# EAGLE design rectificador (EAGLE 9.6.2)
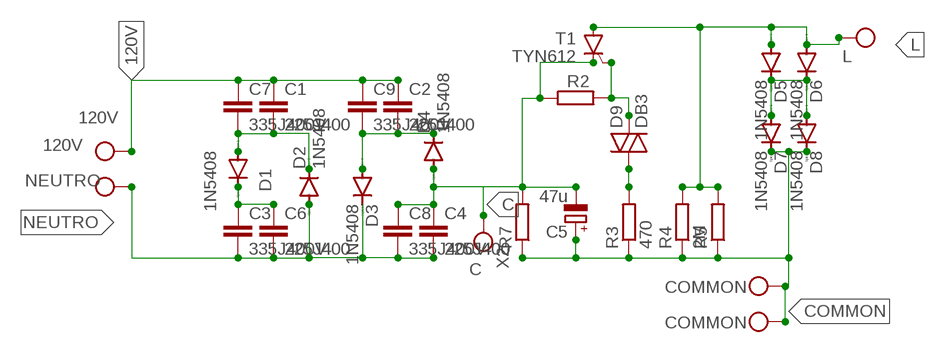
[diagram p0: schematic, sheet 1]

## Parts
C1  225J400  C15/9  [C15B9]
C2  225J400  C15/9  [C15B9]
C3  335J400V  C15/9  [C15B9]
C4  225J400  C15/9  [C15B9]
C5  47u  CPOL-EUE2-5  [E2-5]
C6  225J400  C15/9  [C15B9]
C7  335J400V  C15/9  [C15B9]
C8  335J400V  C15/9  [C15B9]
C9  335J400V  C15/9  [C15B9]
D1  1N5408  1N5400  [DO201-15]
D2  1N5408  1N5400  [DO201-15]
D3  1N5408  1N5400  [DO201-15]
D4  1N5408  1N5400  [DO201-15]
D5  1N5408  1N5400  [DO201-15]
D6  1N5408  1N5400  [DO201-15]
D7  1N5408  1N5400  [DO201-15]
D8  1N5408  1N5400  [DO201-15]
D9  DB3  DIAC-DO35-10  [DO35-10]
R2  R-EU_0207/10  [0207/10]
R3  470  R-EU_0207/10  [0207/10]
R4  2M  R-EU_0207/10  [0207/10]
R5  R-EU_0207/10  [0207/10]
R7  R-EU_0207/10  [0207/10]
T1  TYN612  TIC126  [TO220CS]
VIN  120V  W237-102  [W237-102]
X2  X2  W237-4  [W237-4]

## Nets
120V: C1.1 C2.1 C7.1 C9.1 VIN.2
C: C4.1 C5.- C8.1 D4.A R2.1 R7.2 T1.C X2.4
COMMON: C5.+ D7.C D8.C R3.1 R4.1 R5.1 R7.1 X2.2 X2.3
L: D5.A D6.A R4.2 R5.2 T1.A X2.1
N$1: D9.A R3.2
N$3: C3.1 C6.1 D1.C
N$6: C2.2 C9.2 D3.A D4.C
N$17: C1.2 C7.2 D1.A D2.C
N$21: D5.C D6.C D7.A D8.A
N$49: D9.C R2.2 T1.G
NEUTRO: C3.2 C4.2 C6.2 C8.2 D2.A D3.C VIN.1

## Library data of the parts
C1-C4 C7-C9 = capacitor-wima:C: CAPACITOR naming: grid - package width; OC_NEWARK: unknown
C5 = rcl:CPOL-EU: POLARIZED CAPACITOR, European symbol; MF: PEPPERL+FUCHS; MPN: V3-WM-E2-5M-PUR; OC_NEWARK: 29M6143; SPICEPREFIX: C
C6 = capacitor-wima:C: CAPACITOR naming: grid - package width; OC_NEWARK: unknown; SPICEPREFIX: C
D1-D8 = diode:1N5400: DIODE standard rectifier, 3 A, 50 V (Motorola); OC_NEWARK: unknown
D9 = diode:DIAC-: DIAC; OC_NEWARK: unknown
R2-R5 R7 = rcl:R-EU_: RESISTOR, European symbol; OC_NEWARK: unknown; SPICEPREFIX: R
T1 = triac:TIC126: THYRISTOR; OC_NEWARK: unknown
VIN = con-wago-500:W237-102: WAGO SCREW CLAMP; MF: WAGO; MPN: 237-102; OC_FARNELL: unknown; OC_NEWARK: 70K9898
X2 = con-wago-500:W237-4: WAGO SCREW CLAMP; OC_FARNELL: unknown; OC_NEWARK: unknown

## Board
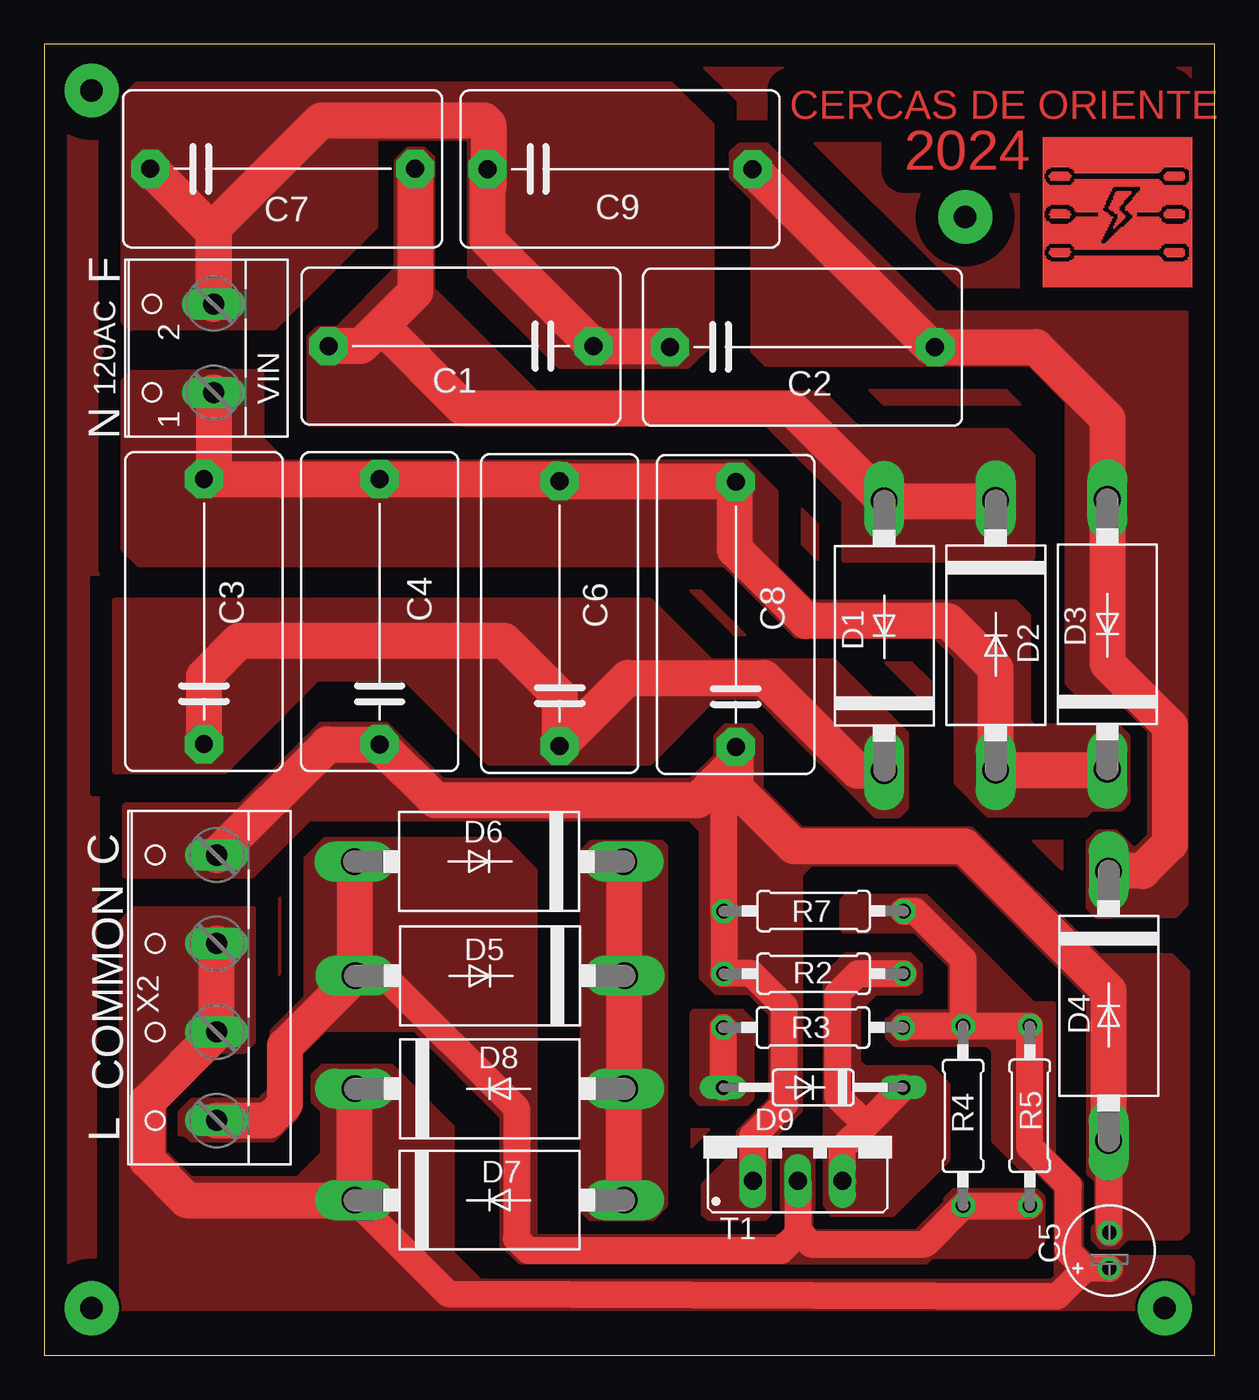
[diagram p1: board, top side]
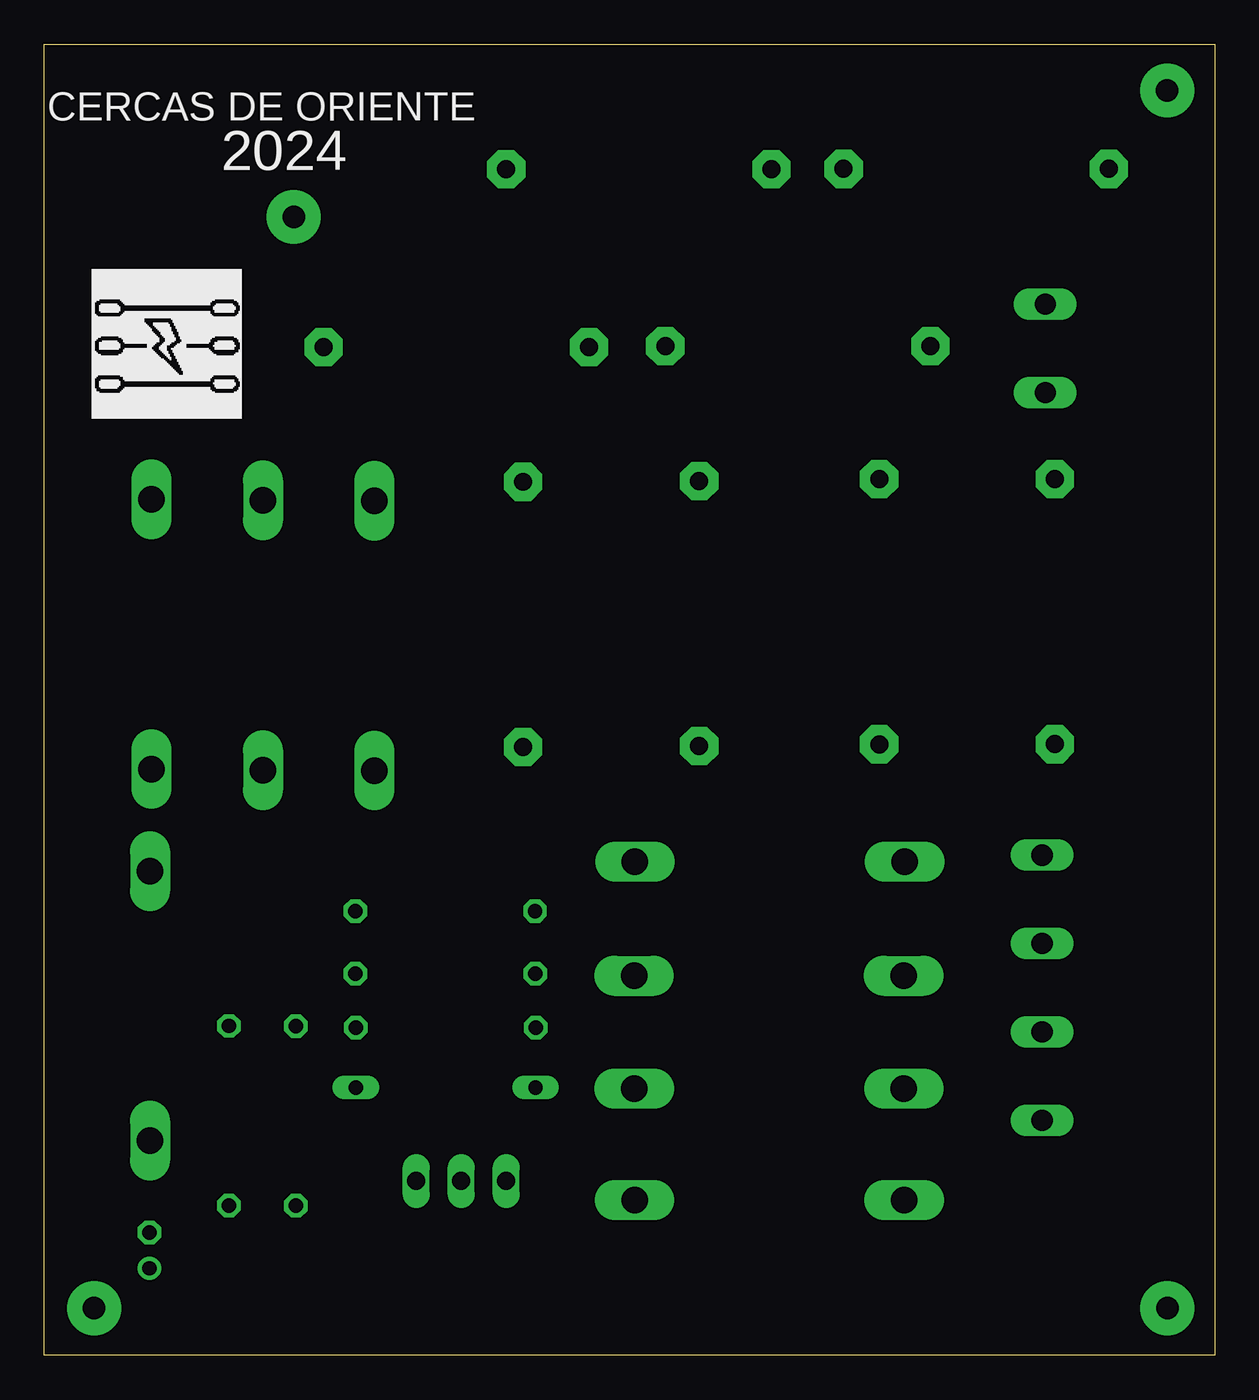
[diagram p2: board, bottom side, seen from below]

Size 66.16 x 74.1 mm. Coordinates in mm from the lower left corner, seen from the top.
Outline: 0,0 66.16,0 66.16,74.1 0,74.1 0,0
Copper layers (1*16): Top 0.035mm / dielectric 1.5mm / Bottom 0.035mm
Design rules "default *": minimum track width 6mil, minimum drill 0.35mm, track to track 6mil, track to pad 6mil, pad to pad 6mil, via to via 6mil, smd to smd 6mil, copper to edge 40mil, drill to drill 6mil, minimum pad ring 10mil, minimum via ring 8mil, stop-mask expansion 4mil, vias tented up to drill 0mil, thermal gap 10mil

### Footprints (pad centres in the part's own frame; a part is rotated, then mirrored left to right if it is on the bottom)
C15B9 = drill 1.016 pad 2.159 octagon: 1 -7.493,0; 2 7.493,0
E2-5 = drill 0.813 pad 1.27: + -1.016,0 | drill 0.813 pad 1.27 octagon: - 1.016,0
DO201-15 = drill 1.499 long: A 7.62,0; C -7.62,0
DO35-10 = drill 0.813 long: A 5.08,0; C -5.08,0
0207/10 = drill 0.813 octagon: 1 -5.08,0; 2 5.08,0
TO220CS = drill 1.016 long: A 0,-2.54; C -2.54,-2.54; G 2.54,-2.54
W237-102 = drill 1.194 long: 1 -2.5,-1.27; 2 2.5,-1.27
W237-4 = drill 1.194 long: 1 -7.5,-1.27; 2 -2.5,-1.27; 3 2.5,-1.27; 4 7.5,-1.27

### Placement (x,y rotation side)
C1  23.56,57.04 180 top
C2  42.86,56.98 0 top
C3  9.03,42.03 90 top
C4  18.96,42.03 90 top
C5  60.21,5.93 90 top
C6  29.13,41.93 90 top
C7  13.47,67.06 0 top
C8  39.09,41.88 90 top
C9  32.55,67.05 0 top
D1  47.48,40.67 90 top
D2  53.79,40.7 270 top
D3  60.09,40.75 90 top
D4  60.17,19.75 270 top
D5  25.19,21.45 180 top
D6  25.15,27.91 180 top
D7  25.17,8.77 0 top
D8  25.18,15.06 0 top
D9  43.46,15.13 180 top
R2  43.48,21.57 0 top
R3  43.46,18.53 180 top
R4  51.93,13.53 270 top
R5  55.71,13.54 270 top
R7  43.49,25.11 180 top
T1  42.59,12.4 0 top
VIN  8.3,56.92 90 top
X2  8.48,20.77 90 top

### Tracks (layer width: path | path; a pad name or v marks a point on that pad's centre or on a via)
120V
  Top 2.032: C7.1 9.57,63.47 VIN.2 9.57,63.73 15.65,69.8 24.87,69.8 25.11,69.56 25.11,65.98 25.06,65.93 | 25.06,65.93 25.06,63.04 C1.1 35.31,57.04 C2.1 | 25.06,65.93 C9.1
  pour Top (no thermals): 4.54,58.39 4.88,58.05 13.02,58.05 18.77,63.8 18.77,68.74 18.8,68.77 24.02,68.77 24.02,60.97 29.12,55.87 36.39,55.87 37.76,57.24 37.76,69.55 35.43,71.88 5.22,71.88 4.44,71.1 4.44,58.42 4.88,57.98
C
  Top 1.524: R2.1 R7.2 38.41,32.85 39.09,33.53 | R2.1 | T1.C 40.05,12.4 41.85,14.2 41.85,19.72 39.99,21.57 R2.1 | C5.- 60.21,12.09 D4.A
  Top 2.032: X2.4 16.02,34.54 C4.1 22.11,31.38 36.94,31.38 39.09,33.53 | 39.09,33.53 C8.1 | D4.A 60.17,20.6 52,28.76 42.38,28.76 39.09,32.05 39.09,33.53
  pour Top (no thermals): 4.7,27.07 11.76,27.07 15,30.3 36.48,30.3 36.94,29.85 37.13,29.66 37.13,21.32 37.97,20.48 39.85,20.48 41.04,19.29 41.04,14.46 39.2,12.63 39.2,11.61 37.24,9.65 37.24,8.01 37.54,7.71 40.74,7.71 41.02,7.99 41.02,12.11 42.77,13.86 42.77,14.22 42.77,27.17 43.33,27.73 51.58,27.73 59.02,20.29 59.02,10.3 59.46,9.86 59.46,7.4 59.26,7.21 59.28,7.19 59.28,6.56 59.67,6.17 59.67,6.13 59.69,6.11 60.56,6.11 60.69,6.11 61.18,6.6 64.23,6.6 64.64,7.01 64.64,21.69 63.73,22.6 59.6,22.6 52.42,29.78 42.79,29.78 42.59,29.98 40.54,32.03 40.54,34.99 39.94,35.59 38.51,35.59 37.93,35.01 37.93,33.86 36.57,32.5 22.51,32.5 19.34,35.68 15.63,35.68 11.09,31.14 4.59,31.14 4.51,31.06 4.51,27.09 4.59,27.09
COMMON
  Top 1.524: R3.1 48.62,18.61 R4.1 | R4.1 R5.1 55.71,11.78 57.89,9.6 57.89,5.84 58.82,4.91 | R7.1 49.22,25.11 51.94,22.4 R4.1 | C5.+ 58.82,4.91 | D7.C 22.83,3.48 57.26,3.34 58.82,4.9 58.82,4.91
  Top 2.032: X2.3 X2.2 5.81,14.33 5.81,11.01 8.05,8.77 D7.C 17.55,15.05 D8.C
  pour Top (no thermals): 11.59,17.47 11.83,17.7 11.83,25.25 5.08,25.25 4.83,25.01 4.35,24.52 4.35,2.63 64.19,2.63 64.93,3.37 64.93,5.29 64.68,5.54 59.21,5.54 58.65,6.1 58.65,9.78 58.12,10.31 57.06,11.37 57.06,19.88 55.9,19.88 49.83,25.95 45.31,25.95 45.06,25.71 45.06,24.12 45.21,23.97 49.25,23.97 51.2,22.01 51.2,19.47 51.18,19.45 48.21,19.45 48.16,19.4 47.75,18.99 47.64,18.99 47.64,18 48.09,17.56 53.32,17.56 53.64,17.24 53.64,12.11 55.31,10.44 55.96,10.44 56.01,10.4 56.1,10.4 57.17,9.33 57.17,4.43 56.94,4.2 24.64,4.2 23.08,5.76 23.08,12.92 19.63,16.37 15.72,16.37 15.17,15.81 15.17,14.36 15.7,13.83 15.7,11.38 14.32,10.01 8.31,10.01 6.8,11.51 6.8,14.04 6.96,14.2 9.92,17.16 10.15,17.16 11.29,17.16 11.34,17.21 11.62,17.49 11.62,17.49
L
  Top 1.524: R5.2 R4.2 49.77,6.29 43.36,6.29 42.59,7.05 T1.A 42.59,6.85 41.67,5.93 27.36,5.93 26.69,6.59 26.69,13.97 19.21,21.45 D5.A
  Top 2.032: D6.A 17.57,27.87 D5.A 13.62,17.49 13.62,14.19 12.69,13.27 X2.1
  pour Top (no thermals): 50.14,5.57 55.57,5.57 56.47,6.47 56.47,8.94 56.08,9.33 51.46,9.33 51.44,9.35 50.93,8.83 50.93,8.8 50.93,8.63 49.36,7.06 49.3,7 43.55,7 43.33,7.22 43.33,8.1 43.49,8.27 43.49,11.45 43.16,11.78 42.15,11.78 41.7,11.33 41.7,8.74 41.7,8.27 41.95,8.01 41.95,7.09 41.92,7.06 41.59,6.73 27.79,6.73 27.79,27.41 26.03,29.17 15.87,29.17 14.9,28.2 14.77,28.07 14.77,20.41 14.77,20.23 13.44,18.89 12.85,18.31 12.85,15.12 12.15,14.42 8.65,14.42 8.36,14.42 7.68,13.75 7.66,13.73 7.66,12.5 7.97,12.5 8.32,12.15 12.94,12.15 14.26,13.47 14.26,16.81 15.84,18.38 20.95,18.38 25.86,13.47 25.86,6.14 25.92,6.2 25.92,6.21 26.88,5.25 49.82,5.25 50.11,5.54 50.19,5.54
N$1
  Top 1.524: D9.A R3.2
  pour Top (no thermals): 38.05,14.22 37.08,14.22 36.58,14.72 36.58,19.33 36.71,19.47 39.43,19.47 39.79,19.1 40.02,18.87 40.02,14.51 39.73,14.22
N$2
  pour Top (isolate 1.27, rank 2, no thermals): -0.12,74.01 -0.12,0.17 66.16,0.17 66.16,74.01
N$3
  Top 2.032: C3.1 9.03,38.38 11.04,40.39 26,40.39 29.13,37.26 C6.1 32.98,38.28 40.71,38.28 45.94,33.05 D1.C
  pour Top (no thermals): 10.21,32.97 12.01,34.76 15.43,38.18 19.84,38.18 20.4,38.18 25.13,33.46 34.23,33.46 37.94,37.17 40.28,37.17 42.1,35.35 46.98,30.48 48.3,30.48 48.77,30.95 48.77,35.13 44.64,39.27 37.7,39.27 34.28,42.69 3.97,42.69 3.97,32.99 3.99,32.97
N$4  (via drill 1.27 pad 3.05)
  other vias: 2.68,71.49
N$5  (via drill 1.27 pad 3.05)
  other vias: 2.67,2.66
N$6
  Top 2.032: C9.2 50.11,56.99 C2.2 56.06,56.99 60.1,52.94 60.1,48.39 D3.A 60.09,39.11 63.63,35.57 63.63,28.92 62.08,27.37 D4.C
  pour Top (no thermals): 60.18,24.84 63.93,24.84 64.57,25.48 64.57,58.93 50.36,58.93 40.86,68.43 39.3,68.43 38.83,67.96 38.83,66.58 40.03,65.37 40.03,56.76 40.81,55.98 55.71,55.98 57.81,53.89 57.81,37.96 58.49,37.28 60.48,37.28 62.47,35.29 62.47,29.38 61.75,28.67 61.51,28.67 60.57,29.6 59.58,29.6 58.99,29.01 58.99,25.31 59.49,24.81 60.36,24.81
N$7  (via drill 1.27 pad 3.05)
  other vias: 52.06,64.34
N$8  (via drill 1.27 pad 3.05)
  other vias: 63.34,2.67
N$17
  Top 2.032: C7.2 20.97,60.1 19.06,58.2 | C1.2 17.91,57.04 19.06,58.2 | D2.C 53.76,48.29 D1.A 42.26,53.52 23.74,53.52 19.06,58.2
  pour Top (no thermals): 19.86,67.46 19.86,61.38 16.55,58.07 15.44,58.07 14.95,57.58 14.95,52.68 15.02,52.6 40.84,52.6 41.48,51.96 45.17,48.27 45.17,44.93 55.7,44.93 55.9,45.12 55.9,50.85 54.45,52.29 46.12,52.29 44.01,54.41 27.82,54.41 21.97,60.25 21.97,67.68 21.44,68.21 20.57,68.21 20.45,68.09 19.83,67.46 19.83,67.37
N$21
  Top 2.032: D6.C 32.81,27.87 D5.C 32.8,21.44 D8.A 32.79,15.05 D7.A
  pour Top (no thermals): 30.39,8.76 30.39,28.48 30.92,29.01 34.9,29.01 35.15,28.75 35.15,8.47 34.4,7.72 30.85,7.72 30.41,8.16 30.42,8.85
N$49
  Top 1.524: T1.G 45.13,11.72 46.43,13.02 | 46.43,13.02 D9.C | R2.2 45.98,21.57 44.84,20.43 44.84,14.62 46.43,13.02
  pour Top (no thermals): 44.13,8.52 44.13,21.49 45.3,22.66 48.94,22.66 49.56,22.03 49.56,20.59 49.51,20.54 49.42,20.45 46.99,20.45 46.06,19.51 46.06,16.6 46.38,16.27 50.12,16.27 51.11,15.28 51.11,11.06 47.98,7.93 44.51,7.93
NEUTRO
  Top 2.032: VIN.1 9.57,50.07 C3.2 C4.2 29.03,49.52 C6.2 39.04,49.42 | 39.04,49.42 C8.2 | D3.C 60.03,33.08 D2.A 53.79,38.82 51.11,41.49 43.08,41.49 39.04,45.54 39.04,49.42
  pour Top (no thermals): 4.96,55.57 4.45,55.06 4.45,45.56 5.35,44.66 38.45,44.66 42.48,40.63 50.33,40.63 51.52,39.44 51.52,32.33 53.33,30.52 58.88,30.52 59.2,30.85 60.89,30.85 61.27,31.23 61.27,35.01 60.69,35.59 55.88,35.59 55.66,35.81 55.66,41.81 54.91,42.57 43.34,42.57 41.38,44.53 41.38,48.83 39.7,50.51 13.6,50.51 12.32,51.79 12.32,55.67
(copper drawn outside any net)
  shapes: Top area x265

### Text on the board
Top: CERCAS DE ORIENTE | 2024
bPlace: CERCAS DE ORIENTE | 2024
tNames: F | 120AC | N | C | COMMON | L